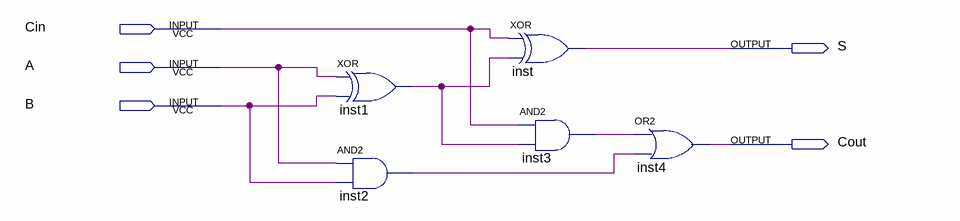
[diagram p0: schematic sheet]
// Quartus schematic fullAdder.bdf as structural Verilog: 5 symbols, 5 pins
module fullAdder (
  input  Cin,
  input  A,
  input  B,
  output S,
  output Cout
);

  wire inst1_out, inst2_out, inst3_out;

  xor inst1 (inst1_out, A, B);
  and inst2 (inst2_out, A, B);
  xor inst (S, Cin, inst1_out);
  and inst3 (inst3_out, Cin, inst1_out);
  or inst4 (Cout, inst3_out, inst2_out);
endmodule
